# EasyEDA schematic ESP32S2-new sensor device v1.0- ENV+MOT sensors.json
TITLE: ESP32 S2 based universal sensor device; REV: 1.0; Date: 2022-09-15; Sheet: 1/1; Drawn By: Zygfryd Homonto; Company: Your Company
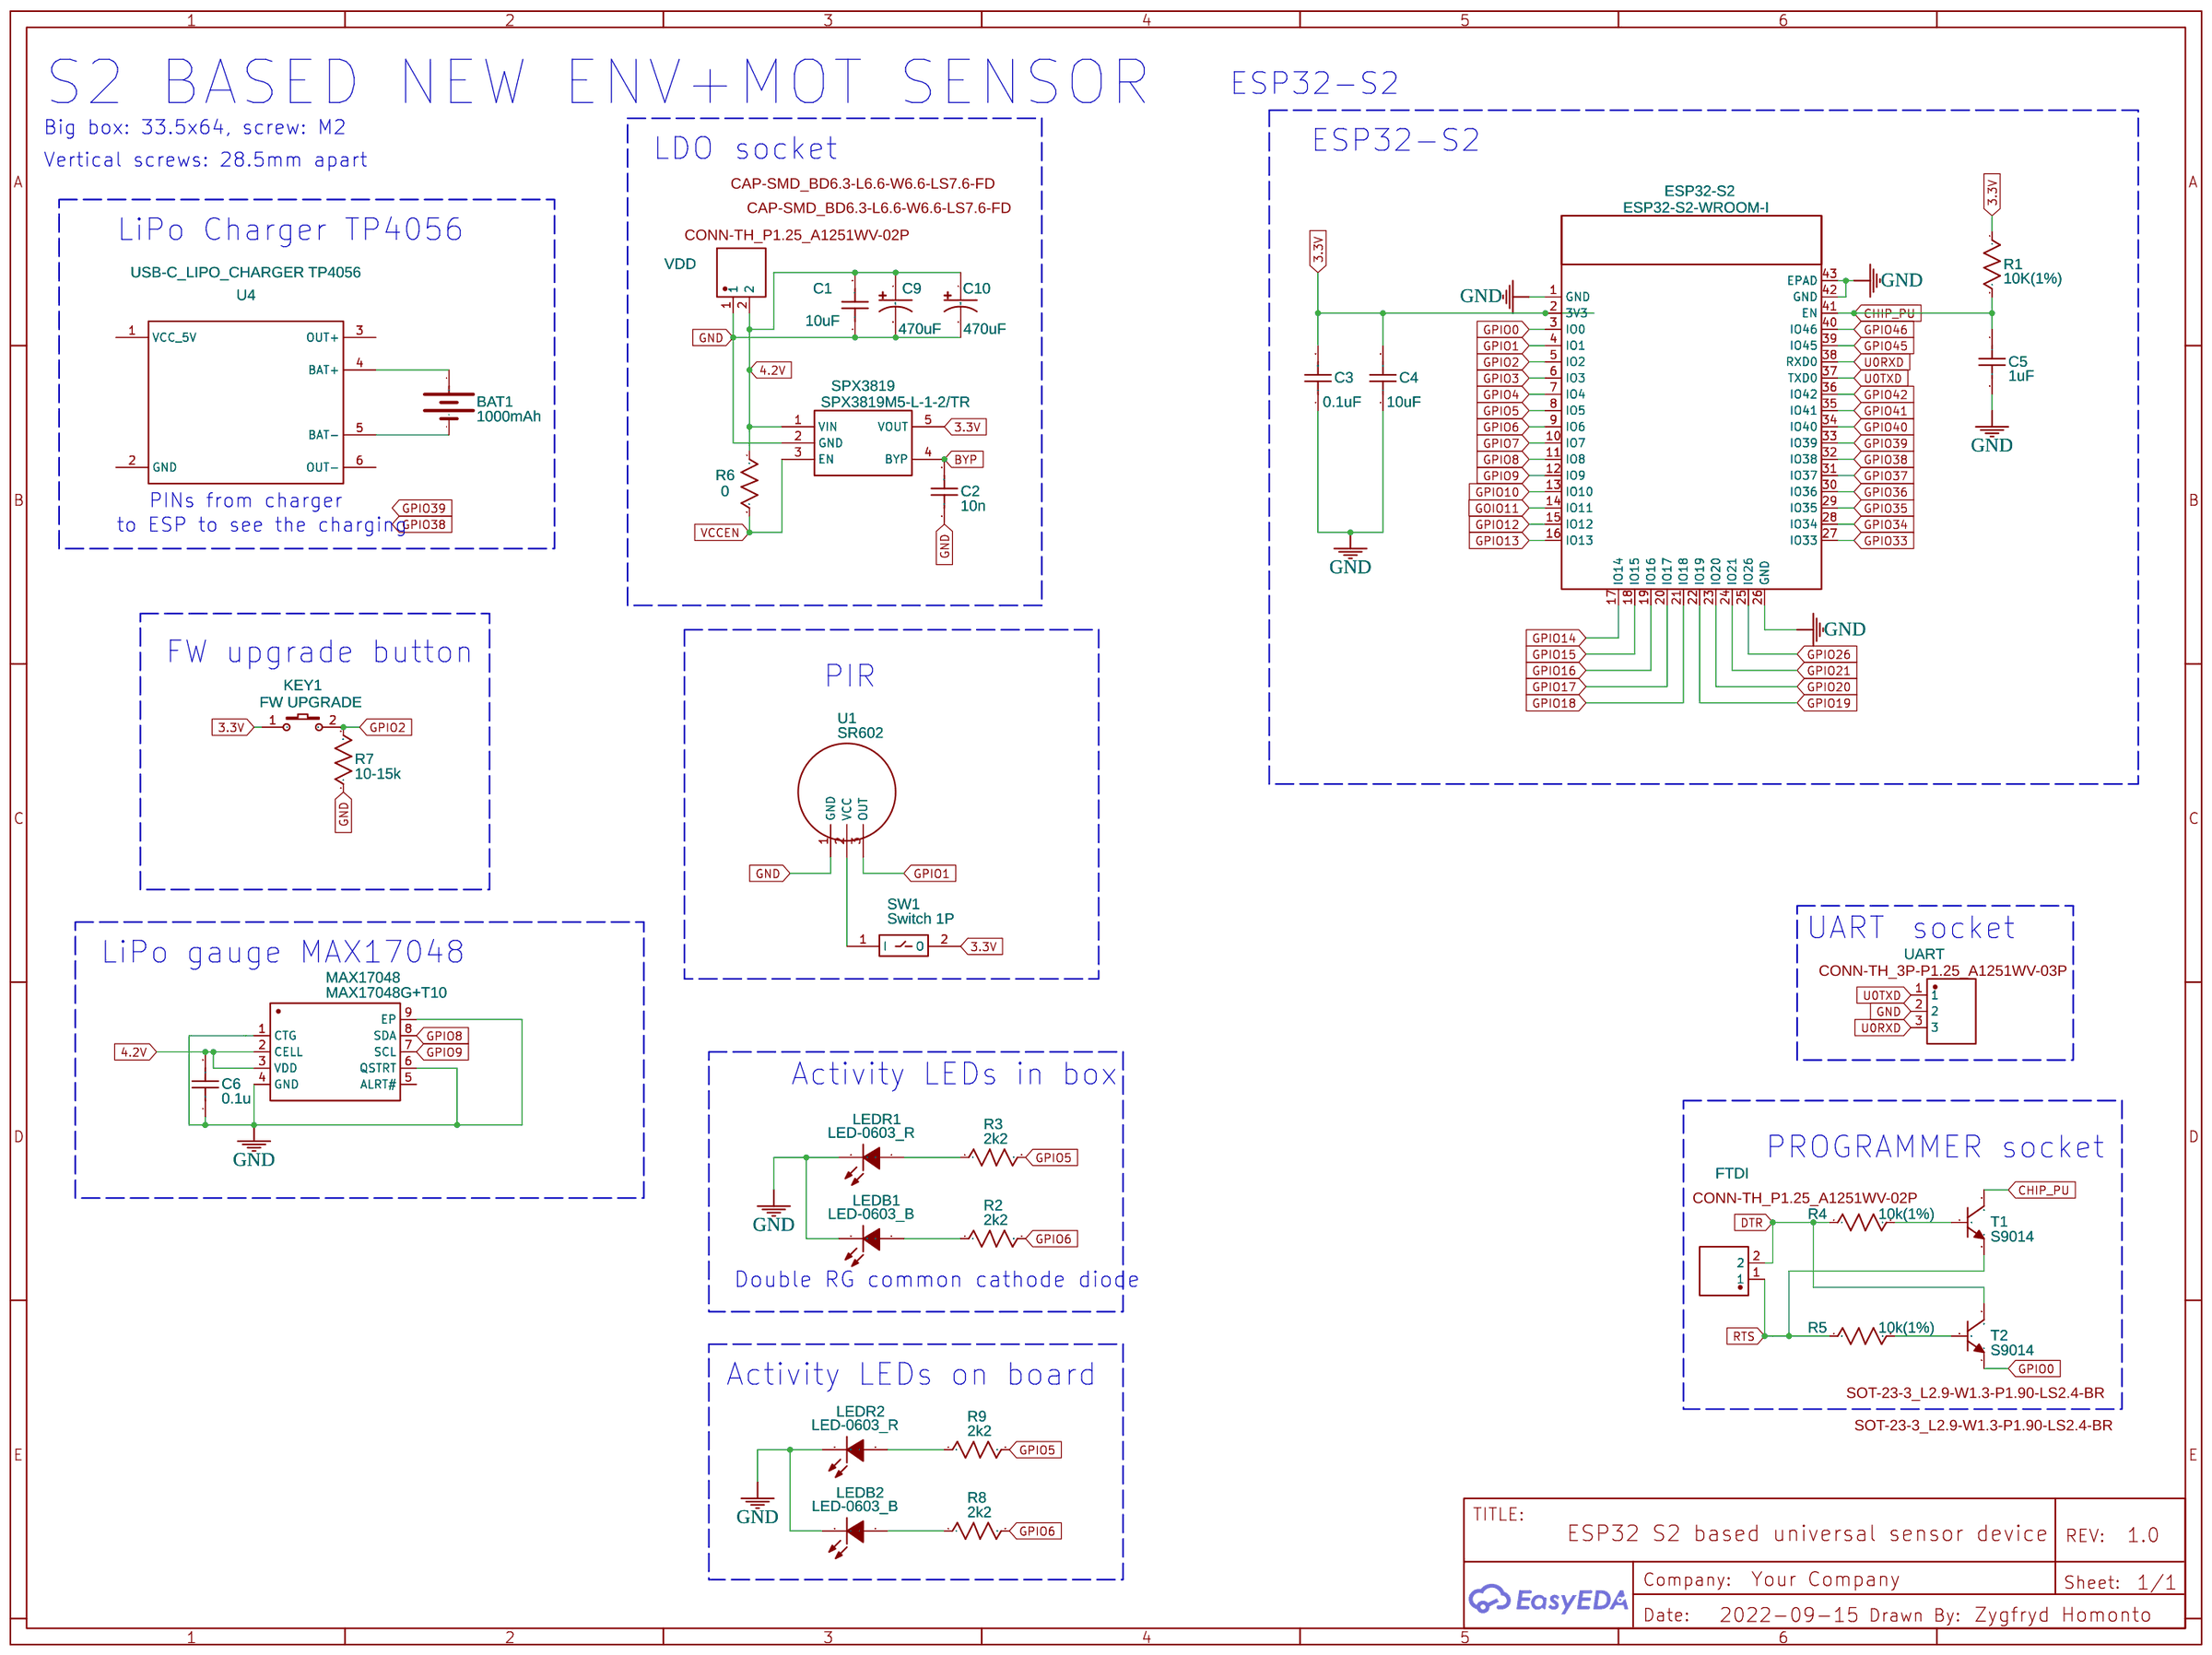
[diagram p0: schematic sheet]

## Parts
BAT1  1000mAh  [LIPO-110-TABS]
C1  10uF  [C0603]
C2  10n  [C0603]
C3  0.1uF  [C0603]
C4  10uF  [C0603]
C5  1uF  [C0603]
C6  0.1u  [C0603]
C9  470uF  [CAP-SMD_BD6.3-L6.6-W6.6-LS7.6-FD]
C10  470uF  [CAP-SMD_BD6.3-L6.6-W6.6-LS7.6-FD]
ESP32-S2  ESP32-S2-WROOM-I  [ESP32-S2-WROOM]
FTDI  A1251WR-2P  [CONN-TH_P1.25_A1251WV-02P]
KEY1  FW UPGRADE  [KEY-SMD_2P-L6.2-W3.6-LS8.0]
LEDB1  LED-0603_B  [LED0603_BLUE]
LEDB2  LED-0603_B  [LED0603_BLUE]
LEDR1  LED-0603_R  [LED0603_RED]
LEDR2  LED-0603_R  [LED0603_RED]
MAX17048  MAX17048G+T10  [DFN-8_L2.0-W2.0-P0.50-BL-EP]
R1  10K(1%)  [C0603]
R2  2k2  [C0603]
R3  2k2  [C0603]
R4  10k(1%)  [C0603]
R5  10k(1%)  [C0603]
R6  0  [C0603]
R7  10-15k  [C0603]
R8  2k2  [C0603]
R9  2k2  [C0603]
SPX3819  SPX3819M5-L-1-2/TR  [SOT-23-5_L3.0-W1.7-P0.95-LS2.8-TL]
SW1  Switch 1P
T1  S9014  [SOT-23-3_L2.9-W1.3-P1.90-LS2.4-BR]
T2  S9014  [SOT-23-3_L2.9-W1.3-P1.90-LS2.4-BR]
U1  SR602  [SR602]
U4  USB-C_LIPO_CHARGER TP4056  [USB_LIPO_CHARGER_PCB]
UART  A1251WR-3P  [CONN-TH_3P-P1.25_A1251WV-03P]
VDD  A1251WR-2P  [CONN-TH_P1.25_A1251WV-02P]

## Library data of the parts
BAT1 = BATTERY: Contributor: SparkFun
C1 C3-C5 = C_0201_US: Contributor: LCEDA_Lib
C2 = C_0603_US: Contributor: LCEDA_Lib; Package Display: No
C6 = C_0603_US: Contributor: LCEDA_Lib
C9 C10 = BXJ-16V220-6.3*7.7: Supplier: LCSC; Supplier Part: C165635; Manufacturer: SamYoung Electronics; Contributor: LCSC; JLCPCB Part Class: Extended Part; Package Display: Yes
ESP32-S2 = ESP32-S2-WROOM: Manufacturer: Espressif Systems; link: https://www.mouser.com/ProductDetail/Espressif-Systems/ESP32-S2-WROVER?qs=sGAEpiMZZMu3sxpa5v1qrtBZTdlU4H0ZBUr%252Bcb7m5M4%3D; Contributor: fabiano.riccardi
FTDI VDD = A1251WR-2P: Supplier: LCSC; Supplier Part: C225097; Manufacturer: Changjiang Connectors; Contributor: LCSC; JLCPCB Part Class: Extended Part; Package Display: Yes
KEY1 = K2-3.6×6.1_SMD: Supplier Part: C118141; Supplier: LCSC; Manufacturer Part: K2-1107ST-A4SW-06; Contributor: LCEDA_Lib; 制造商: 韩国韩荣; Package Display: No
LEDB1 LEDB2 = LED-0603_B: Manufacturer: EVERLIGHT(台湾亿光); Manufacturer Part: 19-217/BHC-ZL1M2RY/3T; Supplier Part: C72041; Supplier: LCSC; Contributor: LCEDA_01; Package Display: No
LEDR1 LEDR2 = LED-0603_R: Manufacturer: EVERLIGHT(台湾亿光); Manufacturer Part: 19-217/R6C-AL1M2VY/3T; Supplier Part: C72044; Supplier: LCSC; Contributor: LCEDA_01; Package Display: No
MAX17048 = MAX17048G+T10: Supplier: LCSC; Supplier Part: C2682616; Manufacturer: MAXIM(美信); JLCPCB Part Class: Extended Part; Contributor: LCSC
R1-R9 = R_0201_US: Contributor: LCEDA_Lib
SPX3819 = SPX3819M5-L-1-2/TR: Supplier: LCSC; Manufacturer: EXAR; Supplier Part: C54988; JLCPCB Part Class: Extended Part; Package Display: No
SW1 = Switch 1P: Contributor: dahe9617; Package Display: Yes
T1 T2 = S9014LT1 (S9014 J6): Supplier: LCSC; Manufacturer: CJ; Supplier Part: C2148; JLCPCB Part Class: Extended Part; Package Display: Yes
U1 = SR602: Contributor: MrSmilling; Package Display: No
U4 = USB_LIPO_CHARGER: Contributor: andy-thx
UART = A1251WR-3P: Supplier: LCSC; Supplier Part: C225098; Manufacturer: Changjiang Connectors; Contributor: LCSC; JLCPCB Part Class: Extended Part; Package Display: Yes

## Nets
3.3V: C3.2 C4.2 ESP32-S2.2(3V3) KEY1.1 R1.1 SPX3819.5(VOUT) SW1.2(O)
4.2V: C1.2 C6.2 C9.1 C10.1 MAX17048.2(CELL) MAX17048.3(VDD) R6.1 SPX3819.1(VIN) VDD.2
GND: C1.1 C2.1 C3.1 C4.1 C5.2 C6.1 C9.2 C10.2 ESP32-S2.1(GND) ESP32-S2.26(GND) ESP32-S2.42(GND) ESP32-S2.43(EPAD) LEDB1.2 LEDB2.2 LEDR1.2 LEDR2.2 MAX17048.1(CTG) MAX17048.4(GND) MAX17048.6(QSTRT) MAX17048.9(EP) R7.1 SPX3819.2(GND) U1.1(GND) UART.2 VDD.1
VCCEN: R6.2 SPX3819.3(EN)
BYP: C2.2 SPX3819.4(BYP)
CHIP_PU: C5.1 ESP32-S2.41(EN) R1.2 T1.3(C)
DTR: FTDI.2 R4.1 T2.3(C)
GOIO11: ESP32-S2.14(IO11)
GPIO0: ESP32-S2.3(IO0) T2.2(E)
GPIO1: ESP32-S2.4(IO1) U1.3(OUT)
GPIO2: ESP32-S2.5(IO2) KEY1.2 R7.2
GPIO3: ESP32-S2.6(IO3)
GPIO4: ESP32-S2.7(IO4)
GPIO5: ESP32-S2.8(IO5) R3.2 R9.2
GPIO6: ESP32-S2.9(IO6) R2.2 R8.2
GPIO7: ESP32-S2.10(IO7)
GPIO8: ESP32-S2.11(IO8) MAX17048.8(SDA)
GPIO9: ESP32-S2.12(IO9) MAX17048.7(SCL)
GPIO10: ESP32-S2.13(IO10)
GPIO12: ESP32-S2.15(IO12)
GPIO13: ESP32-S2.16(IO13)
GPIO14: ESP32-S2.17(IO14)
GPIO15: ESP32-S2.18(IO15)
GPIO16: ESP32-S2.19(IO16)
GPIO17: ESP32-S2.20(IO17)
GPIO18: ESP32-S2.21(IO18)
GPIO19: ESP32-S2.22(IO19)
GPIO20: ESP32-S2.23(IO20)
GPIO21: ESP32-S2.24(IO21)
GPIO26: ESP32-S2.25(IO26)
GPIO33: ESP32-S2.27(IO33)
GPIO34: ESP32-S2.28(IO34)
GPIO35: ESP32-S2.29(IO35)
GPIO36: ESP32-S2.30(IO36)
GPIO37: ESP32-S2.31(IO37)
GPIO38: ESP32-S2.32(IO38)
GPIO39: ESP32-S2.33(IO39)
GPIO40: ESP32-S2.34(IO40)
GPIO41: ESP32-S2.35(IO41)
GPIO42: ESP32-S2.36(IO42)
GPIO45: ESP32-S2.39(IO45)
GPIO46: ESP32-S2.40(IO46)
RTS: FTDI.1 R5.1 T1.2(E)
U0RXD: ESP32-S2.38(RXD0) UART.3
U0TXD: ESP32-S2.37(TXD0) UART.1
Net-(BAT1-+): BAT1.+ U4.4(BAT+)
Net-(BAT1--): BAT1.- U4.5(BAT-)
Net-(LEDB1-1): LEDB1.1 R2.1
Net-(LEDB2-1): LEDB2.1 R8.1
Net-(LEDR1-1): LEDR1.1 R3.1
Net-(LEDR2-1): LEDR2.1 R9.1
Net-(R4-2): R4.2 T1.1(B)
Net-(R5-2): R5.2 T2.1(B)
Net-(SW1-1): SW1.1(I) U1.2(VCC)

Not connected (* = marked no-connect by the designer): MAX17048 5(ALRT#); U4 1(VCC 5V) 2(GND) 3(OUT+) 6(OUT-)

## Notes on the sheet
- S2 BASED NEW ENV+MOT SENSOR
- ESP32-S2
- Big box: 33.5x64, screw: M2
- LDO
- socket
- ESP32-S2
- Vertical screws: 28.5mm apart
- LiPo Charger TP4056
- PINs from charger
- to ESP to see the charging
- FW upgrade button
- PIR
- UART
- socket
- LiPo gauge MAX17048
- Activity LEDs in box
- PROGRAMMER
- socket
- Double RG common cathode diode
- Activity LEDs on board
